# Altium schematic sheet RcMPPT-DCDC.SchDoc: RcMPPT-DCDC
size A4; Author: Thomas Hofmann; CompanyName: HTL St. Pölten; Organization: Altium Limited; Address1: RcMPPT; Address2: Frenchs Forest; Address3: NSW; Address4: Australia 2086; DocumentNumber: 4; Revision: 2.0; SheetNumber: 4; SheetTotal: 8
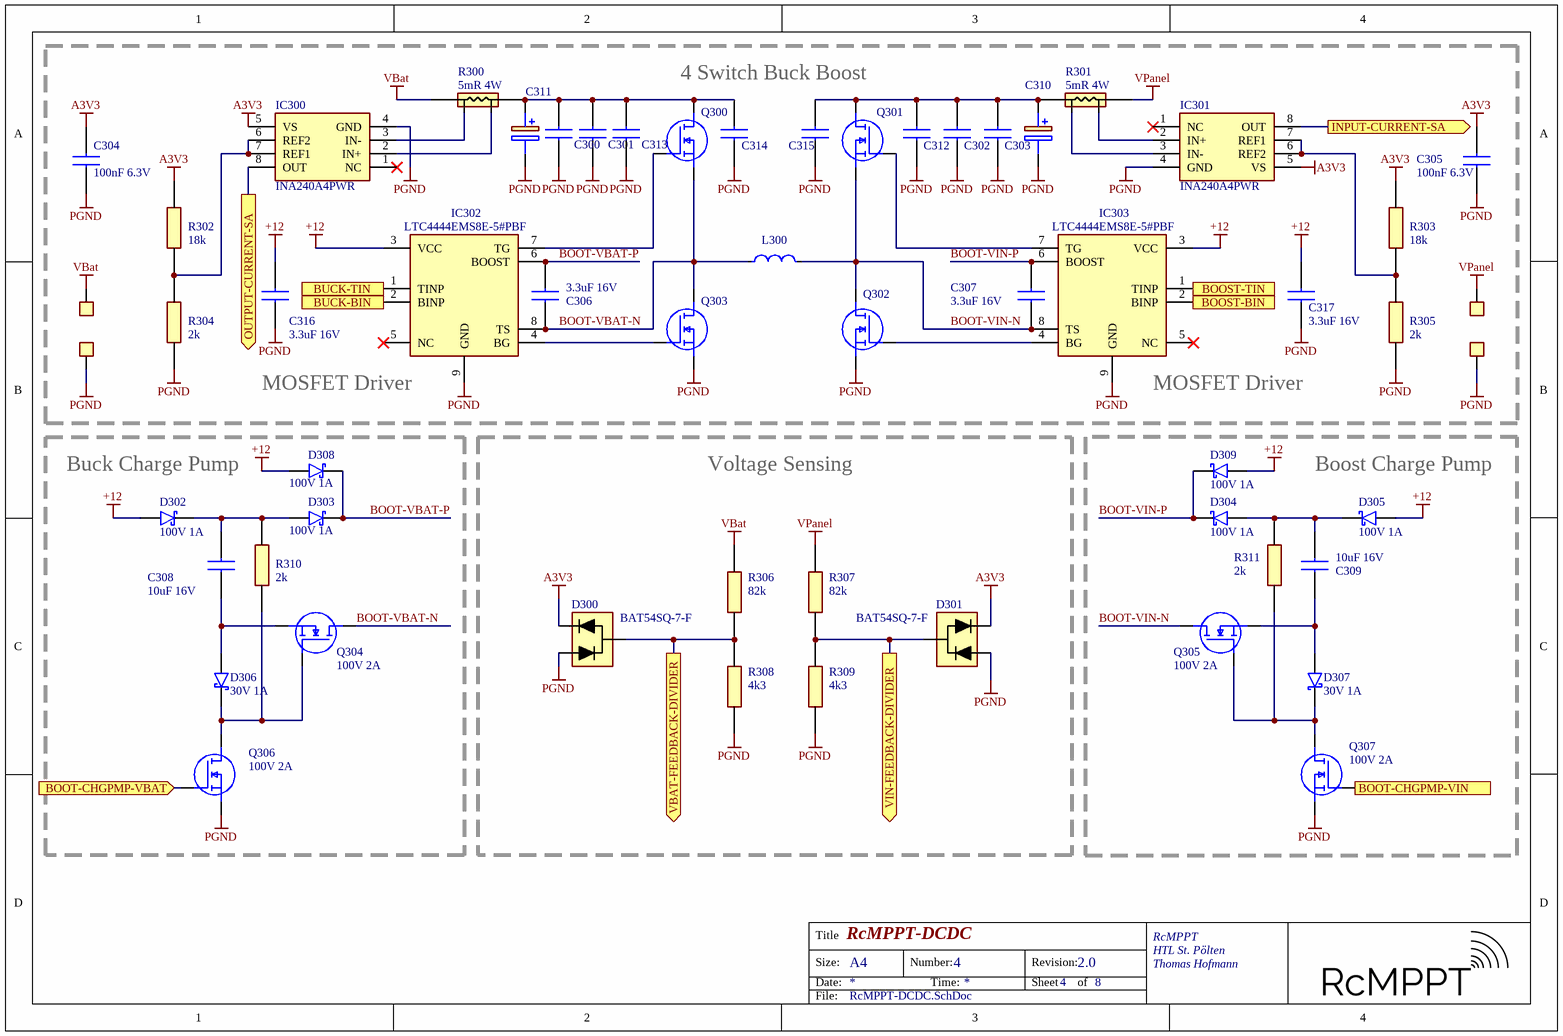
[diagram p0: RcMPPT-DCDC.SchDoc]

## Parts
C300  10uF 100V  [CAPC3225X270N]  (value not drawn)
C301  10uF 100V  [CAPC3225X270N]  (value not drawn)
C302  10uF 100V  [CAPC3225X270N]  (value not drawn)
C303  10uF 100V  [CAPC3225X270N]  (value not drawn)
C304  100nF 6.3V  [CAPC1608X97N]
C305  100nF 6.3V  [CAPC1608X97N]
C306  3.3uF 16V  [CAPC1608X97N]
C307  3.3uF 16V  [CAPC1608X97N]
C308  10uF 16V  [CAPC2012X88N]
C309  10uF 16V  [CAPC2012X88N]
C310  47uF 100VDC 10mm  [CAPAE1030X1050N]  (value not drawn)
C311  47uF 100VDC 10mm  [CAPAE1030X1050N]  (value not drawn)
C312  10uF 100V  [CAPC3225X270N]  (value not drawn)
C313  10uF 100V  [CAPC3225X270N]  (value not drawn)
C314  10uF 100V  [CAPC3225X270N]  (value not drawn)
C315  10uF 100V  [CAPC3225X270N]  (value not drawn)
C316  3.3uF 16V  [CAPC1608X97N]
C317  3.3uF 16V  [CAPC1608X97N]
D300  BAT54SQ-7-F  [SOT96P240X110-3N]
D301  BAT54SQ-7-F  [SOT96P240X110-3N]
D302  100V 1A  [SOD-323]
D303  100V 1A  [SOD-323]
D304  100V 1A  [SOD-323]
D305  100V 1A  [SOD-323]
D306  30V 1A  [SOD-323]
D307  30V 1A  [SOD-323]
D308  100V 1A  [SOD-323]
D309  100V 1A  [SOD-323]
IC300  INA240A4PWR  [SOP65P640X120-8N]
IC301  INA240A4PWR  [SOP65P640X120-8N]
IC302  LTC4444EMS8E-5#PBF  [SOP65P490X110-9N]
IC303  LTC4444EMS8E-5#PBF  [SOP65P490X110-9N]
L300  IHLP6767GZER2R2M01  [FP-IHLP-6767GZ-FP_3_825x1-MFG]  (value not drawn)
P300  PowerPad  [POWER_PAD]  (value not drawn)
P301  PowerPad  [POWER_PAD]  (value not drawn)
P302  PowerPad  [POWER_PAD]  (value not drawn)
P303  PowerPad  [POWER_PAD]  (value not drawn)
Q300  SIR680ADP-T1-RE3  [SI7141DPT1GE3]  (value not drawn)
Q301  SIR680ADP-T1-RE3  [SI7141DPT1GE3]  (value not drawn)
Q302  SIR680ADP-T1-RE3  [SI7141DPT1GE3]  (value not drawn)
Q303  SIR680ADP-T1-RE3  [SI7141DPT1GE3]  (value not drawn)
Q304  100V 2A  [SI2305TP]
Q305  100V 2A  [SI2305TP]
Q306  100V 2A  [SI2305TP]
Q307  100V 2A  [SI2305TP]
R300  5mR 4W  [FC4L90R005FER]
R301  5mR 4W  [FC4L90R005FER]
R302  18k  [RESC1005X40N]
R303  18k  [RESC1005X40N]
R304  2k  [RESC1005X40N]
R305  2k  [RESC1005X40N]
R306  82k  [RESC1608X50N]
R307  82k  [RESC1608X50N]
R308  4k3  [RESC1608X50N]
R309  4k3  [RESC1608X50N]
R310  2k  [RESC1608X50N]
R311  2k  [RESC1608X50N]

## Blocks framed on the sheet
Buck Charge Pump: C308 D302 D303 D306 D308 Q304 Q306 R310
Voltage Sensing: D300 D301 R306-R309
Boost Charge Pump: C309 D304 D305 D307 D309 Q305 Q307 R311

## Ports
BOOST-BIN (in), BOOST-TIN (in), BOOT-CHGPMP-VBAT (in), BOOT-CHGPMP-VIN (in), BUCK-BIN (in), BUCK-TIN (in), INPUT-CURRENT-SA (out), OUTPUT-CURRENT-SA (out), VBAT-FEEDBACK-DIVIDER (out), VIN-FEEDBACK-DIVIDER (out)

## Nets
+12: C316.1 C317.1 D302.2(A) D305.2(A) D308.2(A) D309.2(A) IC302.3(VCC) IC303.3(VCC)
A3V3: C304.2 C305.2 D300.2(K) D301.2(K) IC300.5(VS) IC301.5(VS) R302.2 R303.2
PGND: C300.2 C301.2 C302.2 C303.2 C304.1 C305.1 C310.2(-) C311.2(-) C312.2 C313.2 C314.2 C315.2 C316.2 C317.2 D300.1(A) D301.1(A) IC300.4(GND) IC301.4(GND) IC302.9(GND) IC303.9(GND) P302.1 P303.1 Q302.1,_2,_3(S) Q303.1,_2,_3(S) Q306.2(S) Q307.2(S) R304.1 R305.1 R308.1 R309.1
VBat: P300.1 R300.3 R306.2
VPanel: P301.1 R301.2 R307.2
BOOST-BIN: IC303.2(BINP) ; port BOOST-BIN
BOOST-TIN: IC303.1(TINP) ; port BOOST-TIN
BOOT-CHGPMP-VBAT: Q306.1(G) ; port BOOT-CHGPMP-VBAT
BOOT-CHGPMP-VIN: Q307.1(G) ; port BOOT-CHGPMP-VIN
BOOT-VBAT-N: C306.2 IC302.8(TS) L300.1 Q300.1,_2,_3(S) Q303.5,6,7,8,9,10,11(D) Q304.3(D)
BOOT-VBAT-P: C306.1 D303.1(K) D308.1(K) IC302.6(BOOST)
BOOT-VIN-N: C307.2 IC303.8(TS) L300.2 Q301.1,_2,_3(S) Q302.5,6,7,8,9,10,11(D) Q305.3(D)
BOOT-VIN-P: C307.1 D304.1(K) D309.1(K) IC303.6(BOOST)
BUCK-BIN: IC302.2(BINP) ; port BUCK-BIN
BUCK-TIN: IC302.1(TINP) ; port BUCK-TIN
INPUT-CURRENT-SA: IC301.8(OUT) ; port INPUT-CURRENT-SA
OUTPUT-CURRENT-SA: IC300.8(OUT) ; port OUTPUT-CURRENT-SA
VBAT-FEEDBACK-DIVIDER: D300.3(A/K) R306.1 R308.2 ; port VBAT-FEEDBACK-DIVIDER
VIN-FEEDBACK-DIVIDER: D301.3(A/K) R307.1 R309.2 ; port VIN-FEEDBACK-DIVIDER
NetC300_1: C300.1 C301.1 C311.1(+) C313.1 C314.1 Q300.5,6,7,8,9,10,11(D) R300.2
NetC302_1: C302.1 C303.1 C310.1(+) C312.1 C315.1 Q301.5,6,7,8,9,10,11(D) R301.3
NetC308_1: C308.1 D306.2(A) Q304.2(S)
NetC308_2: C308.2 D302.1(K) D303.2(A) R310.2
NetC309_1: C309.1 D307.2(A) Q305.2(S)
NetC309_2: C309.2 D304.2(A) D305.1(K) R311.2
NetD306_1: D306.1(K) Q304.1(G) Q306.3(D) R310.1
NetD307_1: D307.1(K) Q305.1(G) Q307.3(D) R311.1
NetIC300_2: IC300.2(IN+) R300.1
NetIC300_3: IC300.3(IN-) R300.4
NetIC300_6: IC300.6(REF2) IC300.7(REF1) R302.1 R304.2
NetIC301_2: IC301.2(IN+) R301.1
NetIC301_3: IC301.3(IN-) R301.4
NetIC301_6: IC301.6(REF2) IC301.7(REF1) R303.1 R305.2
NetIC302_4: IC302.4(BG) Q303.4(G)
NetIC302_7: IC302.7(TG) Q300.4(G)
NetIC303_4: IC303.4(BG) Q302.4(G)
NetIC303_7: IC303.7(TG) Q301.4(G)

Not connected (* = marked no-connect by the designer): IC300 1(NC)*; IC301 1(NC)*; IC302 5(NC)*; IC303 5(NC)*

## Notes on the sheet
- 4 Switch Buck Boost
- (near IC302) MOSFET Driver
- (near IC303) MOSFET Driver
- Title
- Size:
- Date:
- A4
- Number:
- Time:
- Revision:
- Sheet
- of
- RcMPPT
- File:

## Library data of the parts
C300-C303 C312-C315 = C1210: Capacitor; Height: 0.97mm
C304-C307 C316 C317 = C0603: Capacitor; Height: 0.97
C308 C309 = C0805: Capacitor; Height: 0.97
C310 C311 = ELKO: Capacitor Polarised
D300 D301 = BAT54SQ-7-F: Schottky Diode; Manufacturer_Name: Diodes Inc.; Datasheet Link: https://www.arrow.com/en/products/bat54sq-7-f/diodes-incorporated; Height: 1.1mm; Manufacturer_Part_Number: BAT54SQ-7-F; Mouser Part Number: 621-BAT54SQ-7-F; Mouser Price/Stock: https://www.mouser.co.uk/ProductDetail/Diodes-Incorporated/BAT54SQ-7-F/?qs=vdQOMtKMWaAKaYcjx11stw%3D%3D; Arrow Part Number: BAT54SQ-7-F; Arrow Price/Stock: https://www.arrow.com/en/products/bat54sq-7-f/diodes-incorporated
D302-D309 = SCHOTTKY-DIODE: Schottky Diode
IC300 IC301 = INA240A4PWR: Integrated Circuit; Manufacturer_Name: Texas Instruments; Datasheet Link: http://www.ti.com/lit/ds/symlink/ina240.pdf; Height: 1.2mm; Manufacturer_Part_Number: INA240A4PWR; Mouser Part Number: 595-INA240A4PWR; Mouser Price/Stock: https://www.mouser.co.uk/ProductDetail/Texas-Instruments/INA240A4PWR?qs=aVyJF2WnouQ31PAZ9p0r8w%3D%3D; Arrow Part Number: INA240A4PWR; Arrow Price/Stock: https://www.arrow.com/en/products/ina240a4pwr/texas-instruments?region=nac
IC302 IC303 = LTC4444EMS8E-5#PBF: Integrated Circuit; Manufacturer_Name: Linear Technology; Datasheet Link: http://www.linear.com/docs/26366; Height: 1.1mm; Manufacturer_Part_Number: LTC4444EMS8E-5#PBF; Arrow Part Number: LTC4444EMS8E-5#PBF; Arrow Price/Stock: https://www.arrow.com/en/products/ltc4444ems8e-5pbf/linear-technology; Mouser Part Number: 584-C4444EMS8E-5PBF; Mouser Price/Stock: https://www.mouser.com/Search/Refine.aspx?Keyword=584-C4444EMS8E-5PBF
L300 = IHLP6767GZER2R2M01: Commercial Inductors, High Saturation Series 2.2uH 35A 2.53mΩ 20%; Manufacturer: Vishay Dale; Max DC Current: 62A; Shielding: Shielded; Self Resonant Frequency: 2MHz; DC Resistance (DCR): 2.53mR; Core Material: Metal; Test Frequency: 100kHz; Tolerance: 20%; Termination: SMD/SMT; RMS Current (Irms): 35A; Depth: 17.15mm; Package Quantity: 200; Mount: Surface Mount; Case/Package: 6767; Saturation Current: 62A; Radiation Hardening: No; Height - Seated (Max): 0.276inch; Lead Free: Lead Free; Max Operating Temperature: 125°C; Inductance Tolerance: 20%; Packaging: Tape and Reel; Number of Pins: 6767; Current Rating: 35A; Military Standard: Not; Min Operating Temperature: -55°C; Inductance: 2.2uH; Width: 0.675inch; Height: 7mm; Length: 17.15mm; Manufacturer Part Number: IHLP6767GZER2R2M01
Q300-Q303 = SIR680ADP-T1-RE3: MOSFET (N-Channel); pin to pad: 1,2,3>1+2+3 1, 2, 3>1+2+3 5,6,7,8,9,10,11>5+6+7+8+9+10+11; Manufacturer_Name: Vishay; Datasheet Link: https://componentsearchengine.com/Datasheets/2/SIR680ADP-T1-RE3.pdf; Height: 1.12mm; Manufacturer_Part_Number: SIR680ADP-T1-RE3; Mouser Part Number: 78-SIR680ADP-T1-RE3; Mouser Price/Stock: https://www.mouser.co.uk/ProductDetail/Vishay-Semiconductors/SIR680ADP-T1-RE3?qs=Cb2nCFKsA8raqFl13vB9OA%3D%3D
Q304-Q307 = NMOS: MOSFET (N-Channel)
R300 R301 = FC4L90R005FER: Shunt; Manufacturer_Name: Ohmite; Datasheet Link: https://componentsearchengine.com/Datasheets/2/FC4L90R005FER.pdf; Height: 0.8mm; Manufacturer_Part_Number: FC4L90R005FER; Mouser Part Number: 588-FC4L90R005FER; Mouser Price/Stock: https://www.mouser.co.uk/ProductDetail/Ohmite/FC4L90R005FER?qs=lc2O%252BfHJPVbbUOwenJZbzA%3D%3D
R302-R305 = R0402: Resistor; Height: 0.4mm
R306-R311 = R0603: Resistor; Height: 0.55mm